# EasyEDA Pro project NavBot-EN01.epro, schematic SERVO_DEBUG

## Sheets
1 P1: Board Name: SERVO_DEBUG; Create Date: 2025-05-14; Page Name: P1; Project Name: NavBot-EN01; Schematic Name: SERVO_DEBUG; Update Date: 2025-07-09; Add into BOM: yes; Convert to PCB: yes; Date: 2022-08-08; Draw By: MUSHIBO; REV: 1.0; Sheet: 1/1
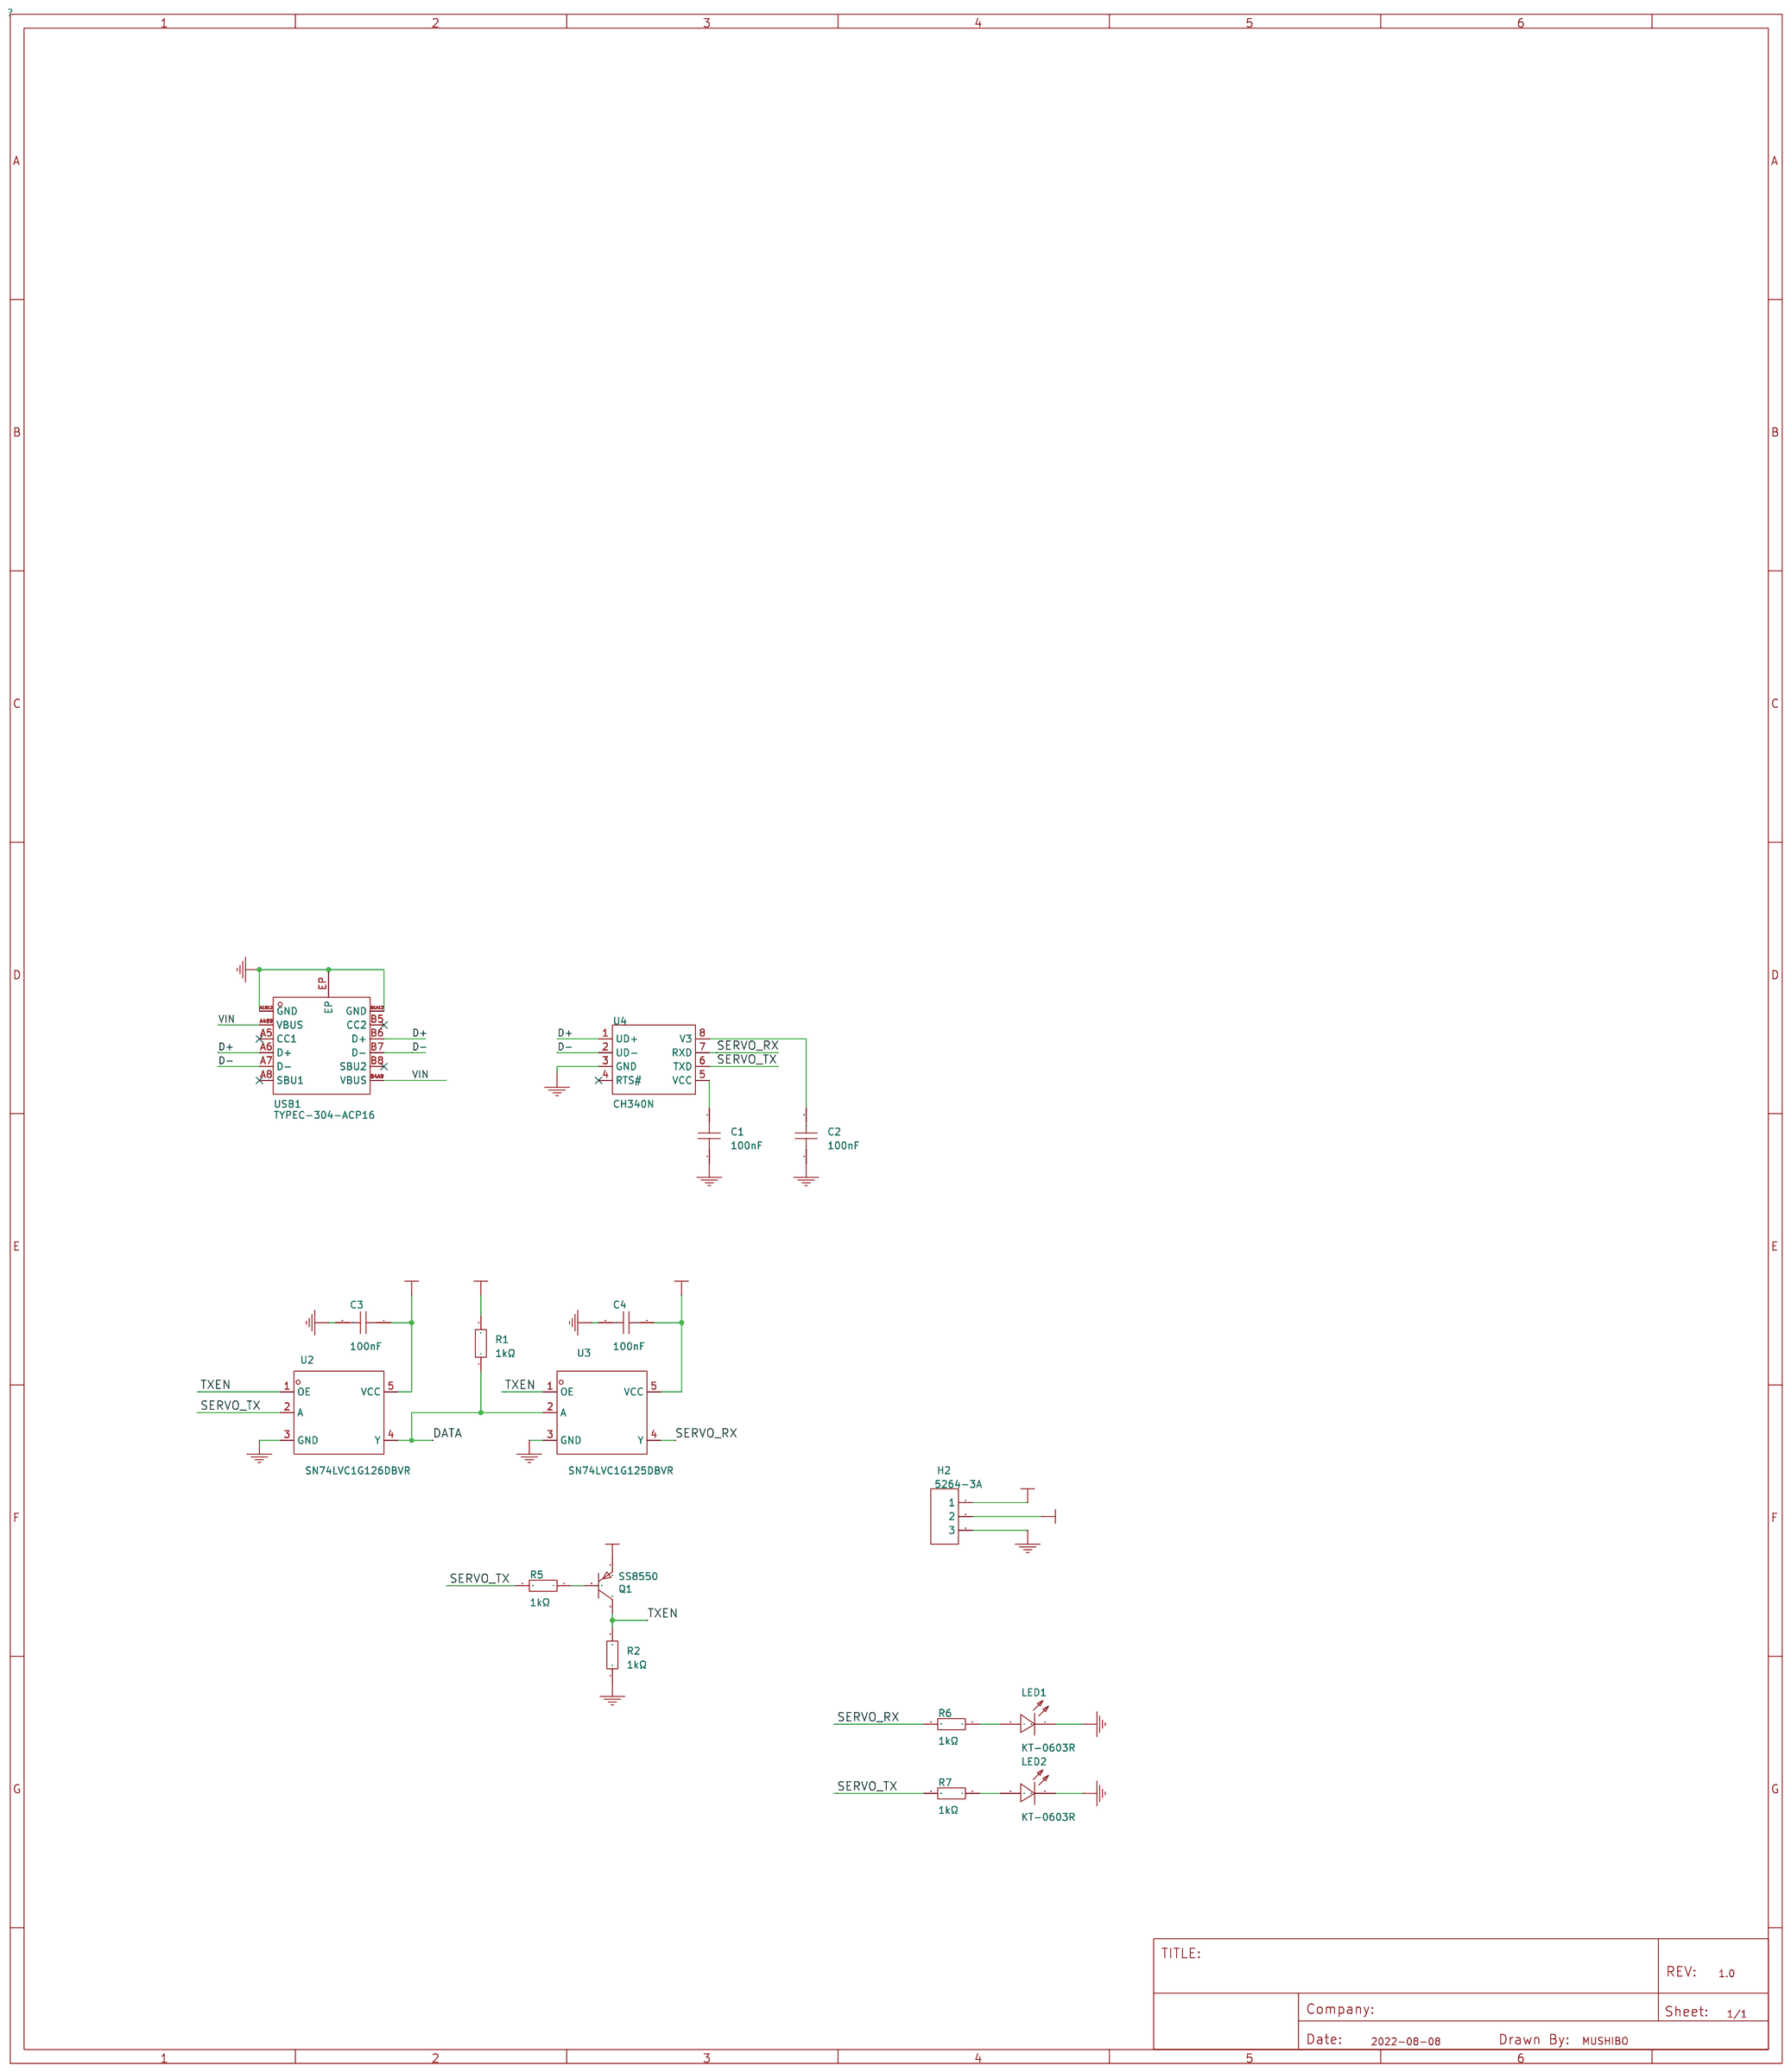
[diagram p4: P1]
2 版本说明: Create Date: 2025-07-21; Page Name: 版本说明; Update Date: 2025-07-21; Company: 嘉立创EDA; Page Size: A4; Version: V1.0
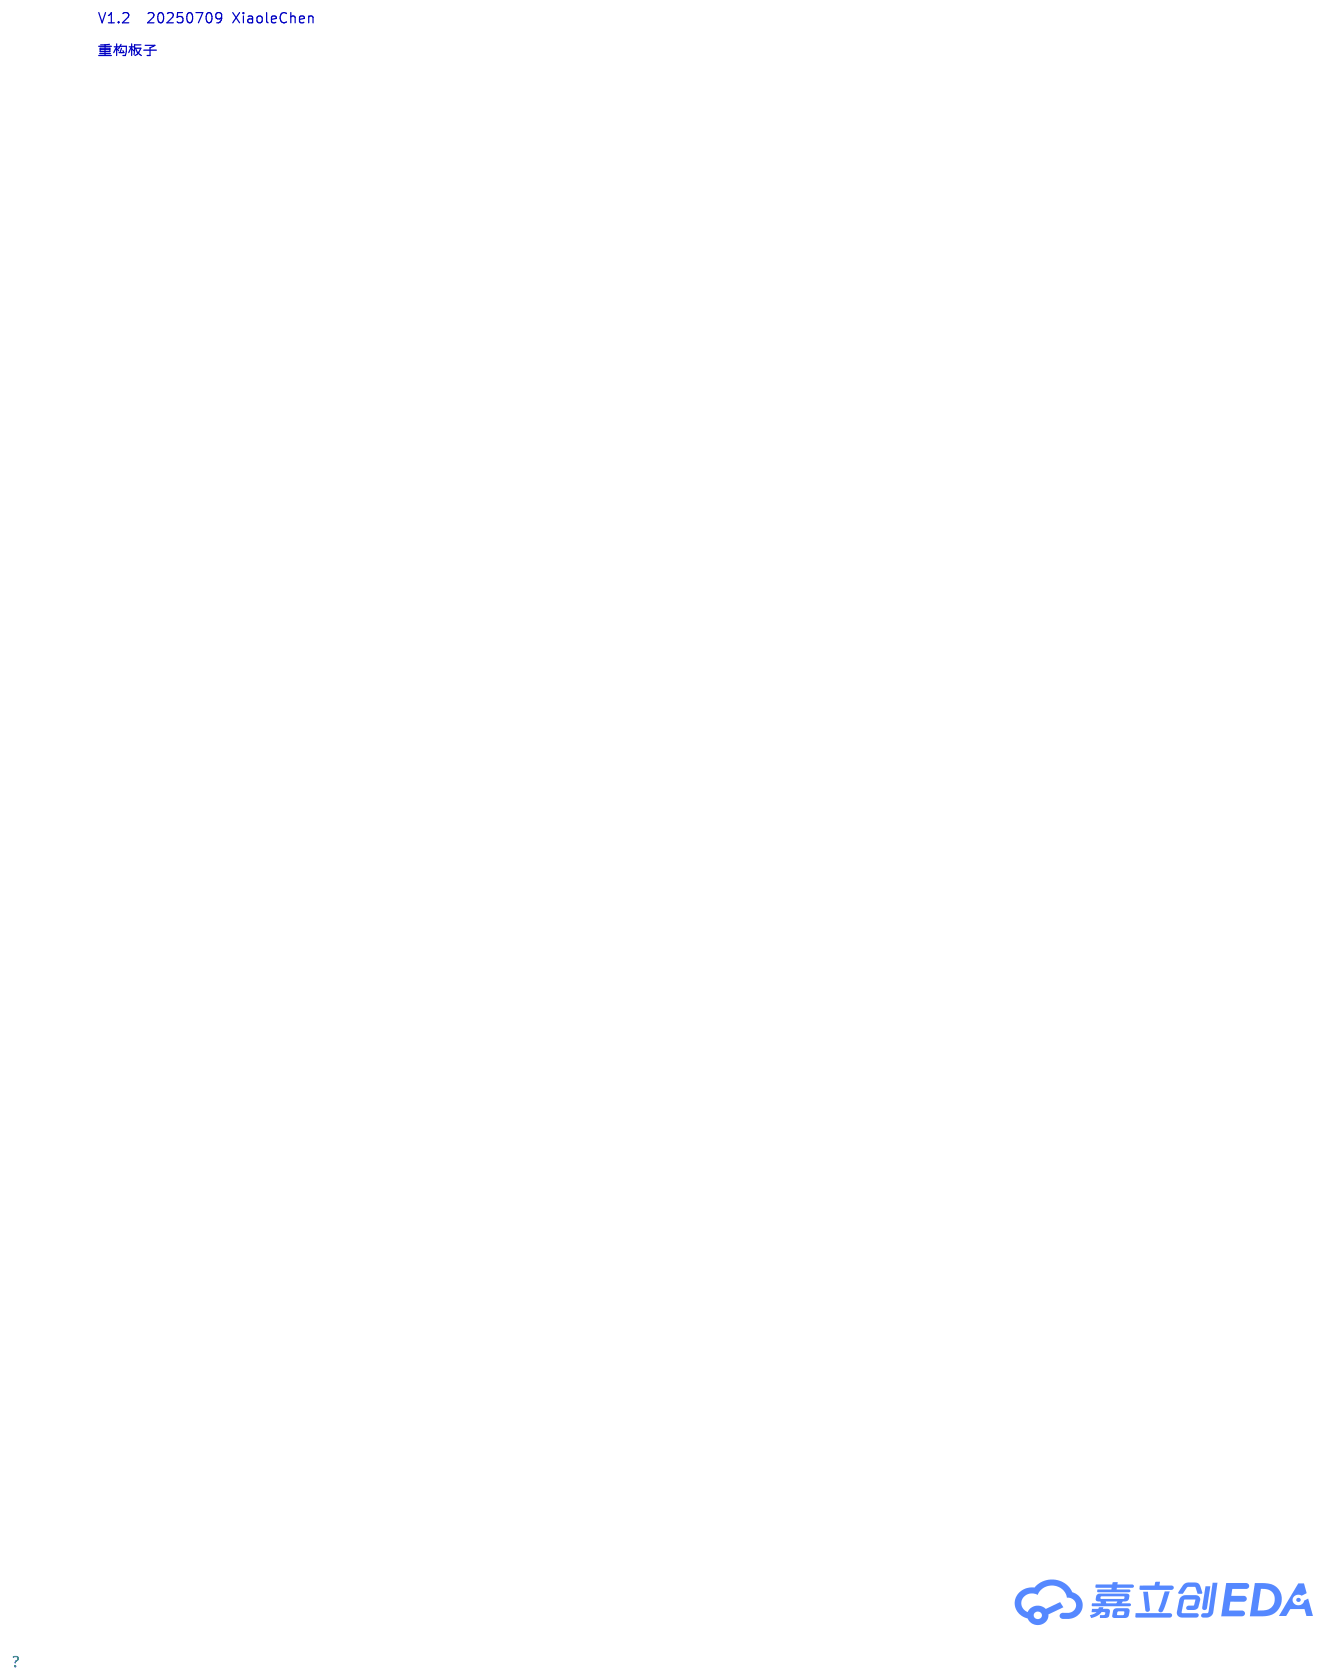
[diagram p5: 版本说明]

## Parts
C1  100nF  [C0603]
C2  100nF  [C0603]
C3  100nF  [C0603]
C4  100nF  [C0603]
H2  5264-3A  [5264-3A]
LED1  KT-0603R  [LED0603-RD]
LED2  KT-0603R  [LED0603-RD]
Q1  SS8550  [SOT-23_L2.9-W1.3-P0.95-LS2.4-BR]
R1  1kΩ  [R0603]
R2  1kΩ  [R0603]
R5  1kΩ  [R0603]
R6  1kΩ  [R0603]
R7  1kΩ  [R0603]
U2  SN74LVC1G126DBVR  [SOT-23-5_L3.0-W1.7-P0.95-LS2.8-BR]
U3  SN74LVC1G125DBVR  [SOT-23-5_L3.0-W1.7-P0.95-LS2.8-BR]
U4  CH340N  [SOP-8_L4.9-W3.9-P1.27-LS6.0-BL]
USB1  TYPEC-304-ACP16  [USB-C-SMD_TYPE-C-16P-1]

## Library data of the parts
C1-C4 = CC0603KRX7R9BB104: 容值:100nF;精度:±10%;额定电压:50V;材质(温度系数):X7R;; LCSC Part Name: 100nF ±10% 50V; Supplier Part: C14663; Manufacturer: YAGEO(国巨); Supplier Footprint: 0603; JLCPCB Part Class: 基础库; Datasheet: https://atta.szlcsc.com/upload/public/pdf/source/20180910/C282072_33301C7F631E79921B82A8DAC6BCC5B3.pdf; Supplier: LCSC; Tolerance: ±10%; Voltage Rated: 50V; Temperature Coefficient: X7R
H2 = 5264-3A: Supplier Part: C146133; Supplier: LCSC
LED1 LED2 = KT-0603R: 发光颜色:红色;功率:-;正向电流:-;主波长:-;二极管配置:-;透镜颜色:-;色温:-;发光角度:-;载带方式:-;工作温度:-40℃~+85℃;; LCSC Part Name: 0603 红灯 高亮; Supplier Part: C2286; Manufacturer: KENTO; Supplier Footprint: 0603; JLCPCB Part Class: 基础库; Datasheet: https://atta.szlcsc.com/upload/public/pdf/source/20160616/1466072038404.pdf; Supplier: LCSC; Emitted Color: 红色; Operating Temperature: -40℃~+85℃
Q1 = SS8550: link: https://item.szlcsc.com/236142.html; 3DModel: SOT-23-3P_L2.9-W1.3-H1.0-LS2.4-P0.95; Supplier: LCSC; Supplier Part: C444726; Manufacturer: Slkor(SLKORMICRO Elec.)
R1 R2 R5-R7 = 0603WAF1001T5E: 电阻类型:厚膜电阻;阻值:1kΩ;精度:±1%;功率:100mW;最大工作电压:75V;温度系数:±100ppm/℃;; LCSC Part Name: 1kΩ ±1% 100mW 厚膜电阻; Supplier Part: C21190; Manufacturer: UNI-ROYAL(厚声); Supplier Footprint: 0603; JLCPCB Part Class: 基础库; Datasheet: https://atta.szlcsc.com/upload/public/pdf/source/20200306/C422600_1E6D84923E4A46A82E41ADD87F860B5C.pdf; Supplier: LCSC; Type: 厚膜电阻; Tolerance: ±1%; Power(Watts): 100mW; Overload Voltage (Max): 75V; Temperature Coefficient: ±100ppm/℃; Operating Temperature Range: -55℃~+155℃
U2 = SN74LVC1G126DBVR: link: https://item.szlcsc.com/236104.html; 3DModel: SOT-23-5_L2.9-W1.6-H1.1-LS2.8-P0.95; Supplier: LCSC; Manufacturer: TI; Manufacturer Part: SN74LVC1G125DBVR; image: //image.lceda.cn/szlcsc/C23654.jpg; Supplier Part: C23654; JLCPCB Part Class: Extend
U3 = SN74LVC1G125DBVR: link: https://item.szlcsc.com/236104.html; 3DModel: SOT-23-5_L2.9-W1.6-H1.1-LS2.8-P0.95; Supplier: LCSC; Manufacturer: TI; image: //image.lceda.cn/szlcsc/C23654.jpg; Supplier Part: C23654; JLCPCB Part Class: Extend
U4 = CH340N: 应用功能:USB转串口;接口协议:USB 2.0;通道数:1;数据速率:2Mbps;; LCSC Part Name: USB2.0芯片CH340; Supplier Part: C2977777; Manufacturer: WCH(南京沁恒); Supplier Footprint: SOP-8; JLCPCB Part Class: 扩展库; Datasheet: https://atta.szlcsc.com/upload/public/pdf/source/20240313/115CDE92081B1D6CB446704AD5D0F5F2.pdf; Supplier: LCSC; Applications Function: USB转串口; Protocol: USB 2.0; Number of Channels: 1; Voltage - Supply: 3.3V；5V; Data Rate: 2Mbps; Operating Temperature: -20℃~+70℃
USB1 = TYPEC-304-ACP16: 连接器类型:Type-C;标准:-;公母:母;端口数量:1;触点数量:16P;安装方式:卧贴;额定电流 - 电源:3A;触头材质:铜;触头镀层:金;工作温度范围:-40℃~+85℃;焊接温度(最大值):-;; LCSC Part Name: Type-C 母 卧贴; Supplier Part: C2982555; Manufacturer: XUNPU(讯普); Supplier Footprint: SMD; JLCPCB Part Class: 扩展库; Datasheet: https://atta.szlcsc.com/upload/public/pdf/source/20220311/3C907F75E12F45E4EE7F73565AB9C294.pdf; Supplier: LCSC; Connector Type: Type-C; Gender: 母; Number of Ports: 1; Number of Contacts: 16P; Mounting Style: 卧贴; Current Rating - Power (Max): 3A; Contact Material: 铜; Contact Plating: 金; Operating Temperature Range: -40℃~+85℃

## Nets
GND: C1.1 C2.1 C3.2 C4.2 H2.3 LED1.1(K) LED2.1(K) R2.1 U2.3(GND) U3.3(GND) U4.3(GND) USB1.A1B12(GND) USB1.B1A12(GND) USB1.EP
VIN: C3.1 C4.1 H2.2 Q1.2(E) R1.2 U2.5(VCC) U3.5(VCC) USB1.A4B9(VBUS) USB1.B4A9(VBUS)
D+: U4.1(UD+) USB1.A6(D+) USB1.B6(D+)
D-: U4.2(UD-) USB1.A7(D-) USB1.B7(D-)
DATA: H2.1 R1.1 U2.4(Y) U3.2(A)
SERVO_RX: R6.2 U3.4(Y) U4.7(RXD)
SERVO_TX: R5.2 R7.2 U2.2(A) U4.6(TXD)
TXEN: Q1.3(C) R2.2 U2.1(OE) U3.1(OE)
$1N3846: Q1.1(B) R5.1
$1N3866: LED1.2(A) R6.1
$1N3867: LED2.2(A) R7.1
$1N4538: C2.2 U4.8(V3)
$1N4568: C1.2 U4.5(VCC)

Not connected (* = marked no-connect by the designer): U4 4(RTS#)*; USB1 A5(CC1)* A8(SBU1)* B5(CC2)* B8(SBU2)*

## Notes on the sheets
sheet 2
- V1.2  20250709 XiaoleChen
  重构板子
